# Altium schematic sheet Opamp.SchDoc
size A4
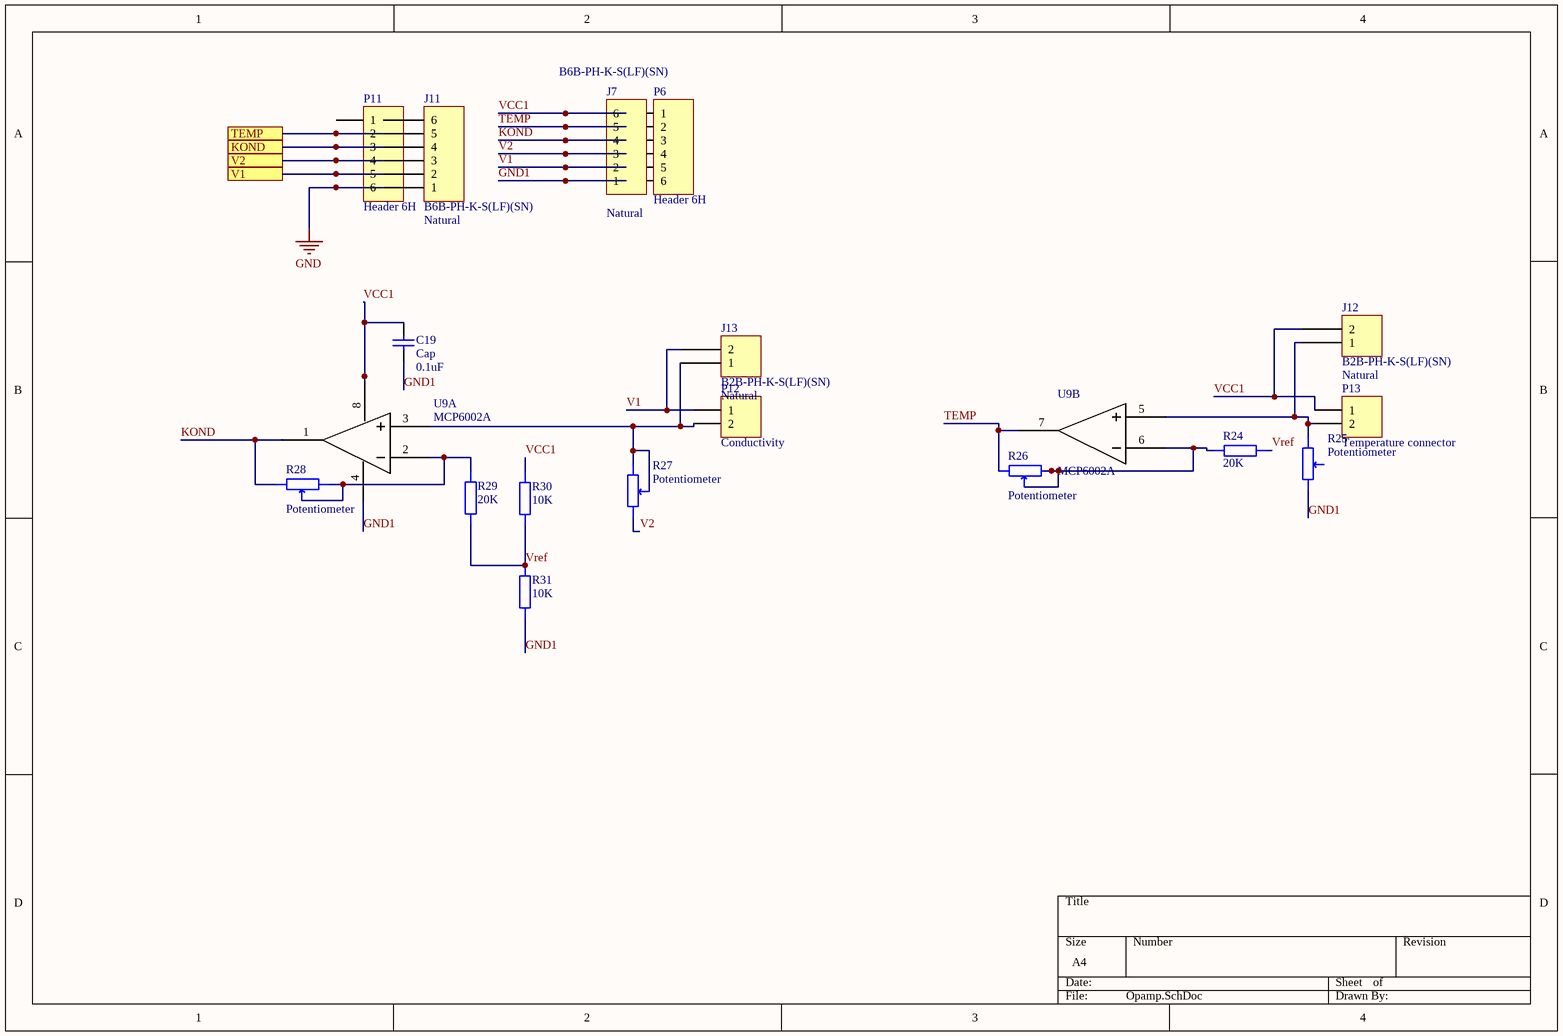
[diagram p0: Opamp.SchDoc]

## Parts
C19  Cap  value 0.1uF  [C0805]
J7  B6B-PH-K-S(LF)(SN)  Colour: Natural  [JST B6B-PH-K]
J11  B6B-PH-K-S(LF)(SN)  Colour: Natural  [JST B6B-PH-K]
J12  B2B-PH-K-S(LF)(SN)  Colour: Natural  [JST B2B-PH-K]
J13  B2B-PH-K-S(LF)(SN)  Colour: Natural  [JST B2B-PH-K]
P6  Header 6H  [HDR1X6]
P11  Header 6H  [HDR1X6H]
P12  Conductivity  [HDR1X2]
P13  Temperature connector  [HDR1X2]
R24  value 20K  [6-0805_L]  (hidden comment: Resistor)
R25  Potentiometer  [Trimmer]
R26  Potentiometer  [Trimmer]
R27  Potentiometer  [Trimmer]
R28  Potentiometer  [Trimmer]
R29  value 20K  [6-0805_L]  (hidden comment: Resistor)
R30  value 10K  [6-0805_L]  (hidden comment: Resistor)
R31  value 10K  [6-0805_L]  (hidden comment: Resistor)
U9  MCP6002A  [SOIC127P600-8N]  (parts A,B of 2)

## Ports
KOND, TEMP, V1, V2

## Nets
GND: J11.1 P11.6
GND1: C19.2 J7.1 P6.6 R25.2 R31.1 U9.4
KOND: J7.4 P6.3 R28.2 U9.1
KOND: J11.4 P11.3 ; port KOND  [a separate net that carries the same name]
TEMP: J7.5 P6.2 R26.2 U9.7
TEMP: J11.5 P11.2 ; port TEMP  [a separate net that carries the same name]
V1: J7.2 J13.2 P6.5 P12.1
V1: J11.2 P11.5 ; port V1  [a separate net that carries the same name]
V2: J7.3 P6.4 R27.2
V2: J11.3 P11.4 ; port V2  [a separate net that carries the same name]
VCC1: C19.1 J7.6 J12.2 P6.1 P13.1 R30.2 U9.8
Vref: R24.1 R29.1 R30.1 R31.2
NetJ12_1: J12.1 P13.2 R25.1 U9.5
NetJ13_1: J13.1 P12.2 R27.1 R27.3 U9.3
NetR24_2: R24.2 R26.1 R26.3 U9.6
NetR28_1: R28.1 R28.3 R29.2 U9.2

Not connected (* = marked no-connect by the designer): J11 6; P11 1; R25 3

## Library data of the parts
C19 = Cap: Capacitor; Published: 8-Jun-2000; LatestRevisionDate: 17-Jul-2002; LatestRevisionNote: Re-released for DXP Platform.; PackageReference: RAD-0.3; Publisher: Altium Limited; PackageDescription: Radial Cap, Thru-Hole; 2 Leads; 0.3 in Pin Spacing
J7 J11 = B6B-PH-K-S(LF)(SN): CONN HEADER PH TOP 6POS 2MM; Manufacturer: JST Sales America Inc.; Pitch: 0.079" (2.00mm); Number Of Positions: 6; Part Number: B6B-PH-K-S(LF)(SN); PartId: 29452; Supplier 1: Digi-Key; Supplier Part Number 1: 455-1708-ND; ComponentLink1Description: Datasheet; ComponentLink1URL: http://www.jst-mfg.com/product/pdf/eng/ePH.pdf; ComponentLink2Description: Digi-Key Listing; ComponentLink2URL: http://www.digikey.com/product-detail/en/jst-sales-america-inc/B6B-PH-K-S(LF)(SN)/455-1708-ND/926615; Price: 0,33; Type: Header, Shrouded; Contact Finish: Tin; Fastening Type: Detent Lock; Number Of Rows: 1; Series: PH
J12 J13 = B2B-PH-K-S(LF)(SN): CONN HEADER PH TOP 2POS 2MM; Manufacturer: JST Sales America Inc.; Pitch: 0.079" (2.00mm); Number Of Positions: 2; Part Number: B2B-PH-K-S(LF)(SN); PartId: 29447; Supplier 1: Digi-Key; Supplier Part Number 1: 455-1704-ND; ComponentLink1Description: Datasheet; ComponentLink1URL: http://www.jst-mfg.com/product/pdf/eng/ePH.pdf; ComponentLink2Description: Digi-Key Listing; ComponentLink2URL: http://www.digikey.com/product-detail/en/jst-sales-america-inc/B2B-PH-K-S(LF)(SN)/455-1704-ND/926611; Price: 0,17; Type: Header, Shrouded; Contact Finish: Tin; Fastening Type: Detent Lock; Number Of Rows: 1; Series: PH
P6 P11 = Header 6H: Header, 6-Pin, Right Angle; LatestRevisionDate: 17-Jul-2002; LatestRevisionNote: Re-released for DXP Platform.; Publisher: Altium Limited
P12 P13 = Header 2: Header, 2-Pin; LatestRevisionDate: 17-Jul-2002; LatestRevisionNote: Re-released for DXP Platform.; Publisher: Altium Limited
R24 R29-R31 = Resistor: Tolerance: 1%; Power Rating: 1/4W; Package: 0602